# Altium schematic sheet AA8513.SCHDOC
size B
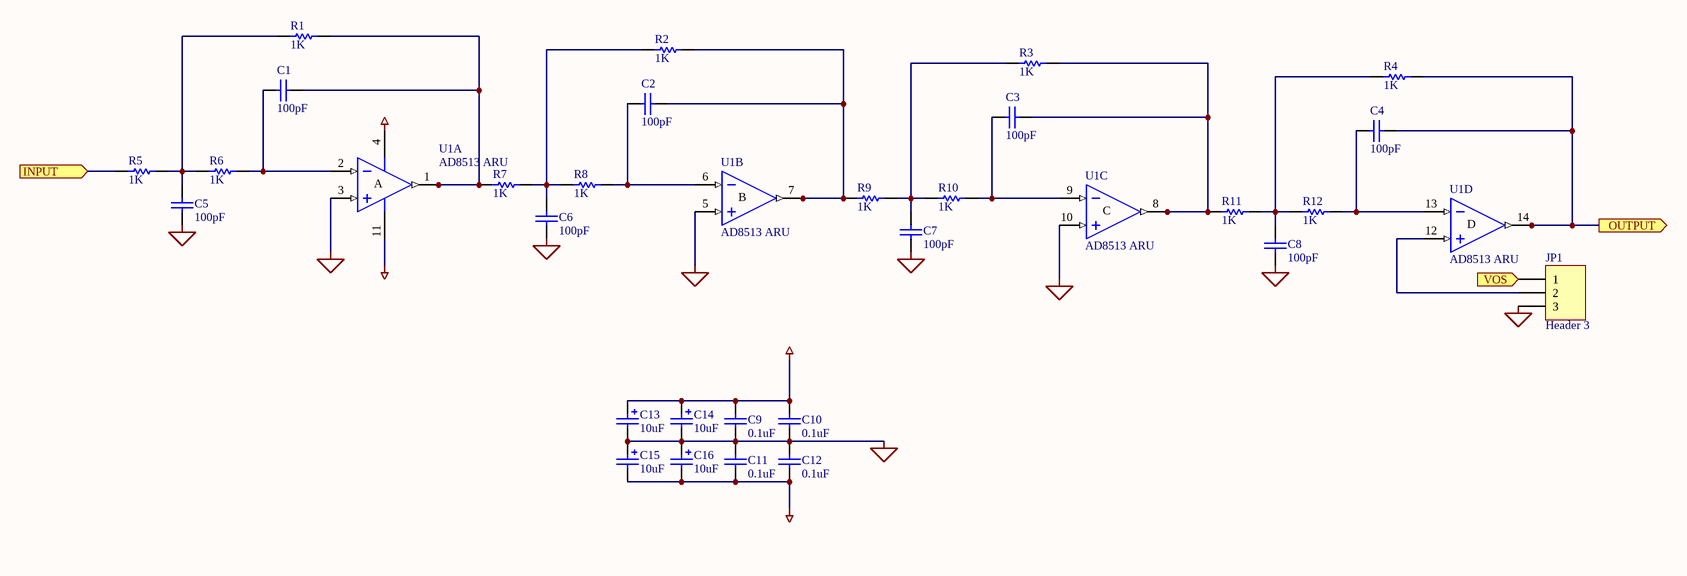
[diagram p0: AA8513.SCHDOC]

## Parts
C1  value 100pF  [CC3216-1206]  (hidden comment: Cap)
C2  value 100pF  [CC3216-1206]  (hidden comment: Cap)
C3  value 100pF  [CC3216-1206]  (hidden comment: Cap)
C4  value 100pF  [CC3216-1206]  (hidden comment: Cap)
C5  value 100pF  [CC3216-1206]  (hidden comment: Cap)
C6  value 100pF  [CC3216-1206]  (hidden comment: Cap)
C7  value 100pF  [CC3216-1206]  (hidden comment: Cap)
C8  value 100pF  [CC3216-1206]  (hidden comment: Cap)
C9  value 0.1uF  [CC1608-0603]  (hidden comment: Cap)
C10  value 0.1uF  [CC1608-0603]  (hidden comment: Cap)
C11  value 0.1uF  [CC1608-0603]  (hidden comment: Cap)
C12  value 0.1uF  [CC1608-0603]  (hidden comment: Cap)
C13  value 10uF  [TC7360-2924]  (hidden comment: Cap Pol1)
C14  value 10uF  [TC7360-2924]  (hidden comment: Cap Pol1)
C15  value 10uF  [TC7360-2924]  (hidden comment: Cap Pol1)
C16  value 10uF  [TC7360-2924]  (hidden comment: Cap Pol1)
JP1  Header 3  [HDR1X3]
R1  value 1K  [CC2012-0805]  (hidden comment: Res1)
R2  value 1K  [CC2012-0805]  (hidden comment: Res1)
R3  value 1K  [CC2012-0805]  (hidden comment: Res1)
R4  value 1K  [CC2012-0805]  (hidden comment: Res1)
R5  value 1K  [CC2012-0805]  (hidden comment: Res1)
R6  value 1K  [CC2012-0805]  (hidden comment: Res1)
R7  value 1K  [CC2012-0805]  (hidden comment: Res1)
R8  value 1K  [CC2012-0805]  (hidden comment: Res1)
R9  value 1K  [CC2012-0805]  (hidden comment: Res1)
R10  value 1K  [CC2012-0805]  (hidden comment: Res1)
R11  value 1K  [CC2012-0805]  (hidden comment: Res1)
R12  value 1K  [CC2012-0805]  (hidden comment: Res1)
U1  AD8513 ARU  [TSSO5X6-G14/X.3]  (parts A,B,C,D of 4)

## Ports
INPUT (in), OUTPUT (out), VOS (in)

## Nets
AVDD: C9.2 C10.2 C13.1 C14.1 U1.4(V+)
AVSS: C11.1 C12.1 C15.2 C16.2 U1.11(V-)
GND: C5.1 C6.1 C7.1 C8.1 C9.1 C10.1 C11.2 C12.2 C13.2 C14.2 C15.1 C16.1 JP1.3 U1.3(IN+A) U1.5(IN+B) U1.10(IN+C)
INPUT: R5.1 ; port INPUT
OUTPUT: C4.1 R4.1 U1.14(OUTD) ; port OUTPUT
VOS: JP1.1 ; port VOS
NetC1_1: C1.1 R1.1 R7.1 U1.1(OUTA)
NetC1_2: C1.2 R6.2 U1.2(IN-A)
NetC2_1: C2.1 R2.1 R9.1 U1.7(OUTB)
NetC2_2: C2.2 R8.2 U1.6(IN-B)
NetC3_1: C3.1 R3.1 R11.1 U1.8(OUTC)
NetC3_2: C3.2 R10.2 U1.9(IN-C)
NetC4_2: C4.2 R12.2 U1.13(IN-D)
NetC5_2: C5.2 R1.2 R5.2 R6.1
NetC6_2: C6.2 R2.2 R7.2 R8.1
NetC7_2: C7.2 R3.2 R9.2 R10.1
NetC8_2: C8.2 R4.2 R11.2 R12.1
NetJP1_2: JP1.2 U1.12(IN+D)

## Notes on the sheet
- (in symbol AD8513ARU, part A) A
- (in symbol AD8513ARU, part B) B
- (in symbol AD8513ARU, part C) C
- (in symbol AD8513ARU, part D) D

## Library data of the parts
C1-C12 = Cap: Capacitor; Manufacturer: Generic Components; Class I: Passive; Published: 8-Jun-2000; Revision: July-2002: Re-released for DXP Platform.; Publisher: Altium Limited; Class II: Capacitor
C13-C16 = Cap Pol1: Polarized Capacitor (Radial); Manufacturer: Generic Components; Class I: Passive; Published: 8-Jun-2000; Revision: July-2002: Re-released for DXP Platform.; Publisher: Altium Limited; Class II: Capacitor
JP1 = Header 3: Header, 3-Pin; Manufacturer: Generic Components; Class I: Connector; Revision: July-2002: Re-released for DXP Platform.; Publisher: Altium Limited
R1-R12 = Res1: Resistor; Manufacturer: Generic Components; Class I: Passive; Published: 8-Jun-2000; Revision: July-2002: Re-released for DXP Platform.; Publisher: Altium Limited; Class II: Resistor
U1 = AD8513ARU: low-noise JFET quad OA